# EAGLE design firefly-instrument-power-supply (EAGLE 7.7.0)
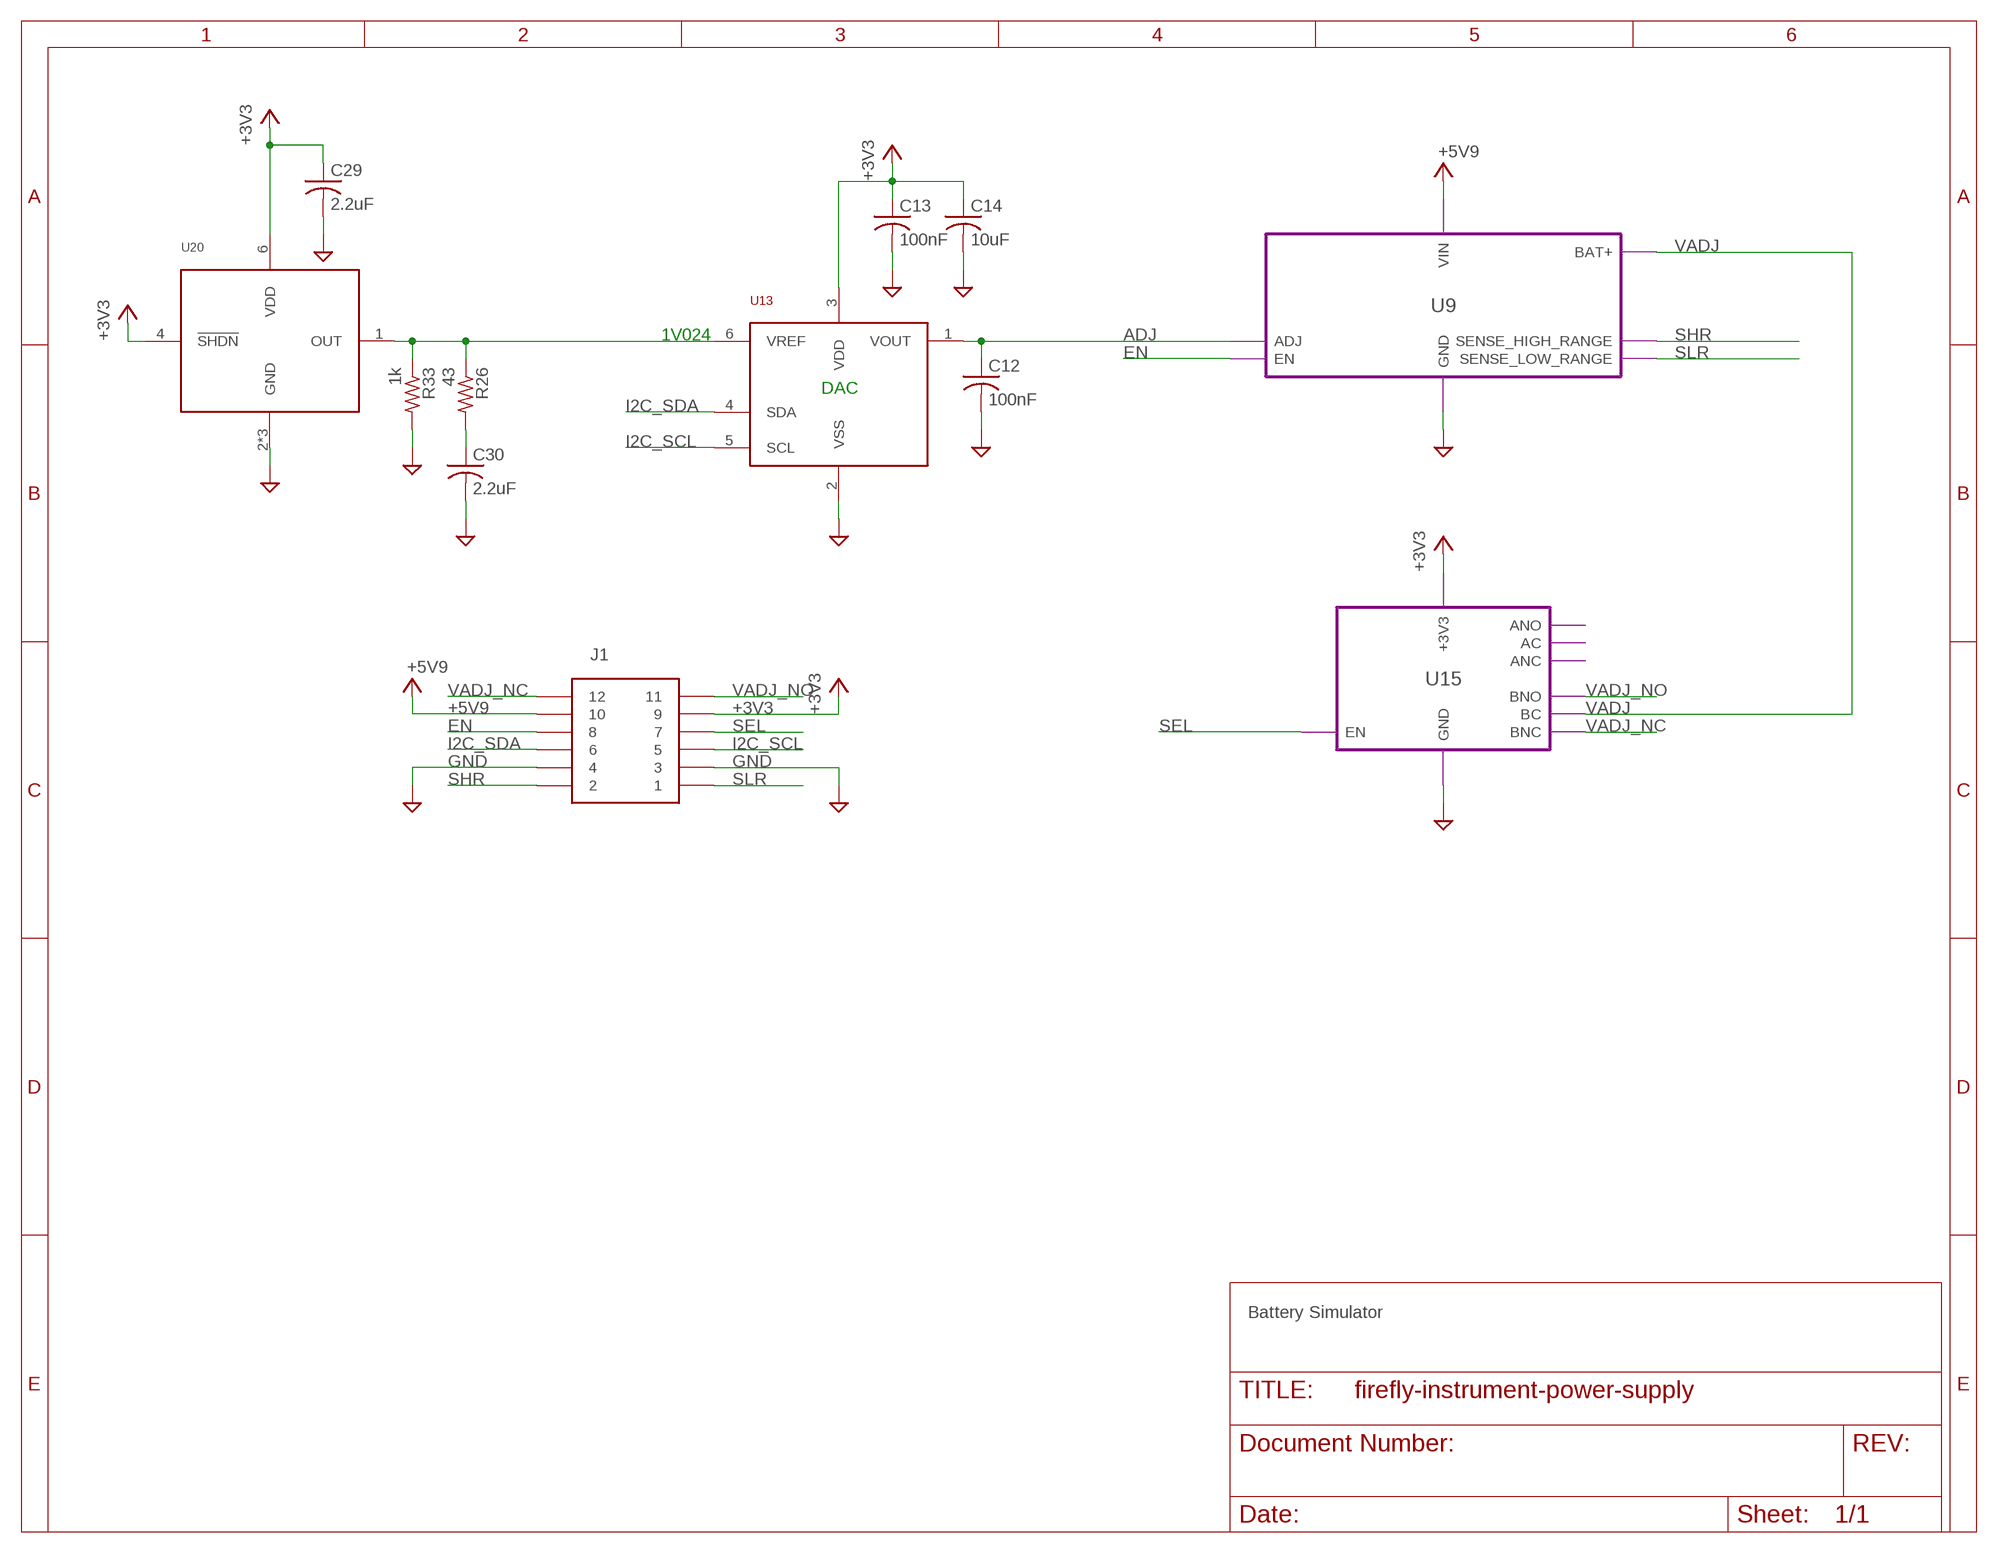
[diagram p0: schematic, sheet 1]

## Parts
C12  100nF  C-USC0805  [C0805]
C13  100nF  C-USC0805  [C0805]
C14  10uF  C-USC0805  [C0805]
C29  2.2uF  C-USC0805  [C0805]
C30  2.2uF  C-USC0805  [C0805]
J1  CON-12CON-HEADER-2X6  [CON-HEADER-2X6]
R26  43  R-USR0805  [R0805]
R33  1k  R-USR0805  [R0805]
U13  MCP47X6  [SOT-23-6]
U20  MCP1501  [SOT-23-6]

## Module instances
U9 = POWER_SUPPLY
U15 = RELAY

## Nets
+3V3: C13.1 C14.1 C29.1 J1.9 U13.3(VDD) U20.4(!SHDN) U20.6(VDD) ; port U15.+3V3
+5V9: J1.10 ; port U9.VIN
ADJ: C12.1 U13.1(VOUT) ; port U9.ADJ
EN: J1.8 ; port U9.EN
GND: C12.2 C13.2 C14.2 C29.2 C30.2 J1.3 J1.4 R33.2 U13.2(VSS) U20.2(GND) U20.3(GND) U20.5(GND) ; port U9.GND U15.GND
I2C_SCL: J1.5 U13.5(SCL)
I2C_SDA: J1.6 U13.4(SDA)
N$22: R26.1 R33.1 U13.6(VREF) U20.1(OUT)
N$30: C30.1 R26.2
SEL: J1.7 ; port U15.EN
SHR: J1.2 ; port U9.SENSE_HIGH_RANGE
SLR: J1.1 ; port U9.SENSE_LOW_RANGE
VADJ: port U15.BC U9.BAT+
VADJ_NC: J1.12 ; port U15.BNC
VADJ_NO: J1.11 ; port U15.BNO

## Notes on the sheet
- 1V024
- DAC
- Battery Simulator

## Library data of the parts
C12 C13 = firefly:C-US: CAPACITOR, American symbol; MANUFACTURER: AVX Corporation; ORDERING-CODE: 08055C104KAT2A
C14 = firefly:C-US: CAPACITOR, American symbol; MANUFACTURER: AVX Corporation; ORDERING-CODE: 0805YD106KAT2A
C29 C30 = firefly:C-US: CAPACITOR, American symbol
J1 = firefly:CON-12
R26 = firefly:R-US: RESISTOR, American symbol; MANUFACTURER: Yageo; ORDERING-CODE: RC0805FR-0743RL
R33 = firefly:R-US: RESISTOR, American symbol; MANUFACTURER: Yageo; ORDERING-CODE: RC0805FR-0710KL
U13 = firefly:MCP47X6; MANUFACTURER: Microchip Technology; ORDERING-CODE: MCP4726A1T-E/CH
U20 = firefly:MCP1501; MANUFACTURER: Microchip Technology; ORDERING-CODE: MCP1501T-10E/CHY

## Module RELAY
Ports: ANO(io) AC(io) ANC(io) BNO(io) BC(io) BNC(io) EN(io) +3V3(pwr) GND(pwr)
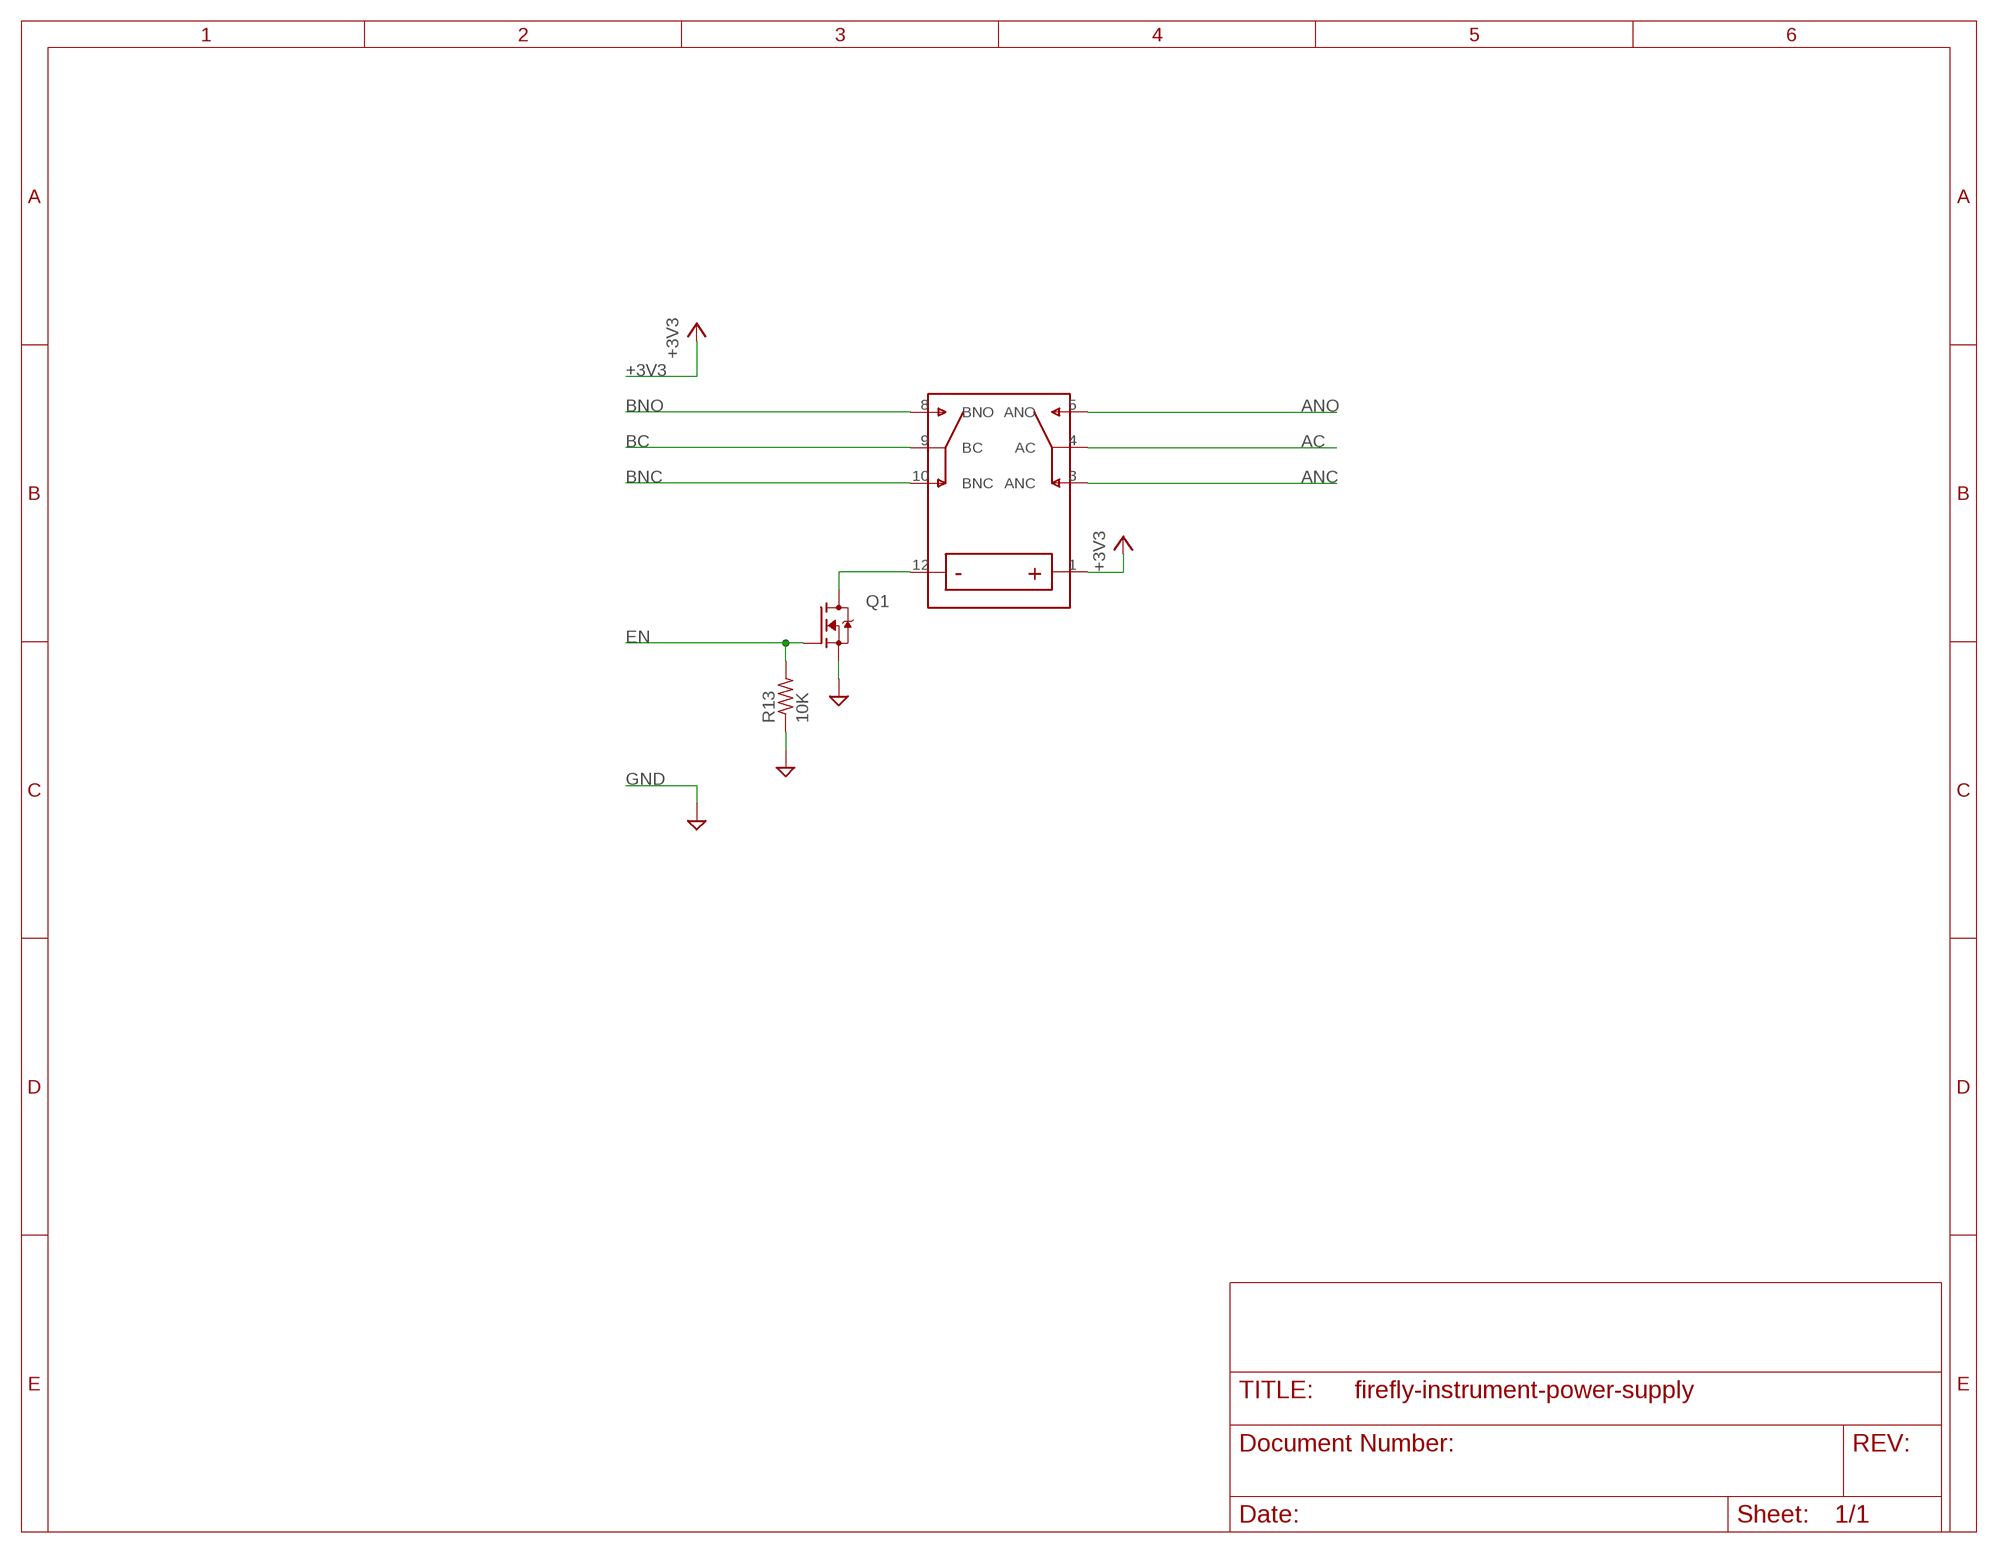
[diagram p1: schematic, module RELAY, sheet 1]

### Parts
Q1  FET-NMCPH3  [MCPH3]
R13  10K  R-USR0805  [R0805]
U1  TXS2SA  [TXS2SA]

### Nets
+3V3: U1.1(+)
AC: U1.4(AC)
ANC: U1.3(ANC)
ANO: U1.5(ANO)
BC: U1.9(BC)
BNC: U1.10(BNC)
BNO: U1.8(BNO)
EN: Q1.1(G) R13.2
GND: Q1.2(S) R13.1
N$2: Q1.3(D) U1.12(-)

### Library data of the parts
Q1 = firefly:FET-N; MANUFACURER: ON Semiconductor; ORDERING-CODE: MCH3481-TL-W
R13 = firefly:R-US: RESISTOR, American symbol; MANUFACTURER: Yageo; ORDERING-CODE: RC0805FR-0710KL
U1 = firefly:TXS2SA; MANUFACTURER: Panasonic Electric Works; ORDERING-CODE: TXS2SA-3V-Z

## Module POWER_SUPPLY
Ports: GND(io) ADJ(io) EN(io) BAT+(io) SENSE_HIGH_RANGE(io) SENSE_LOW_RANGE(io) VIN(pwr)

### Sheet 1 of 2
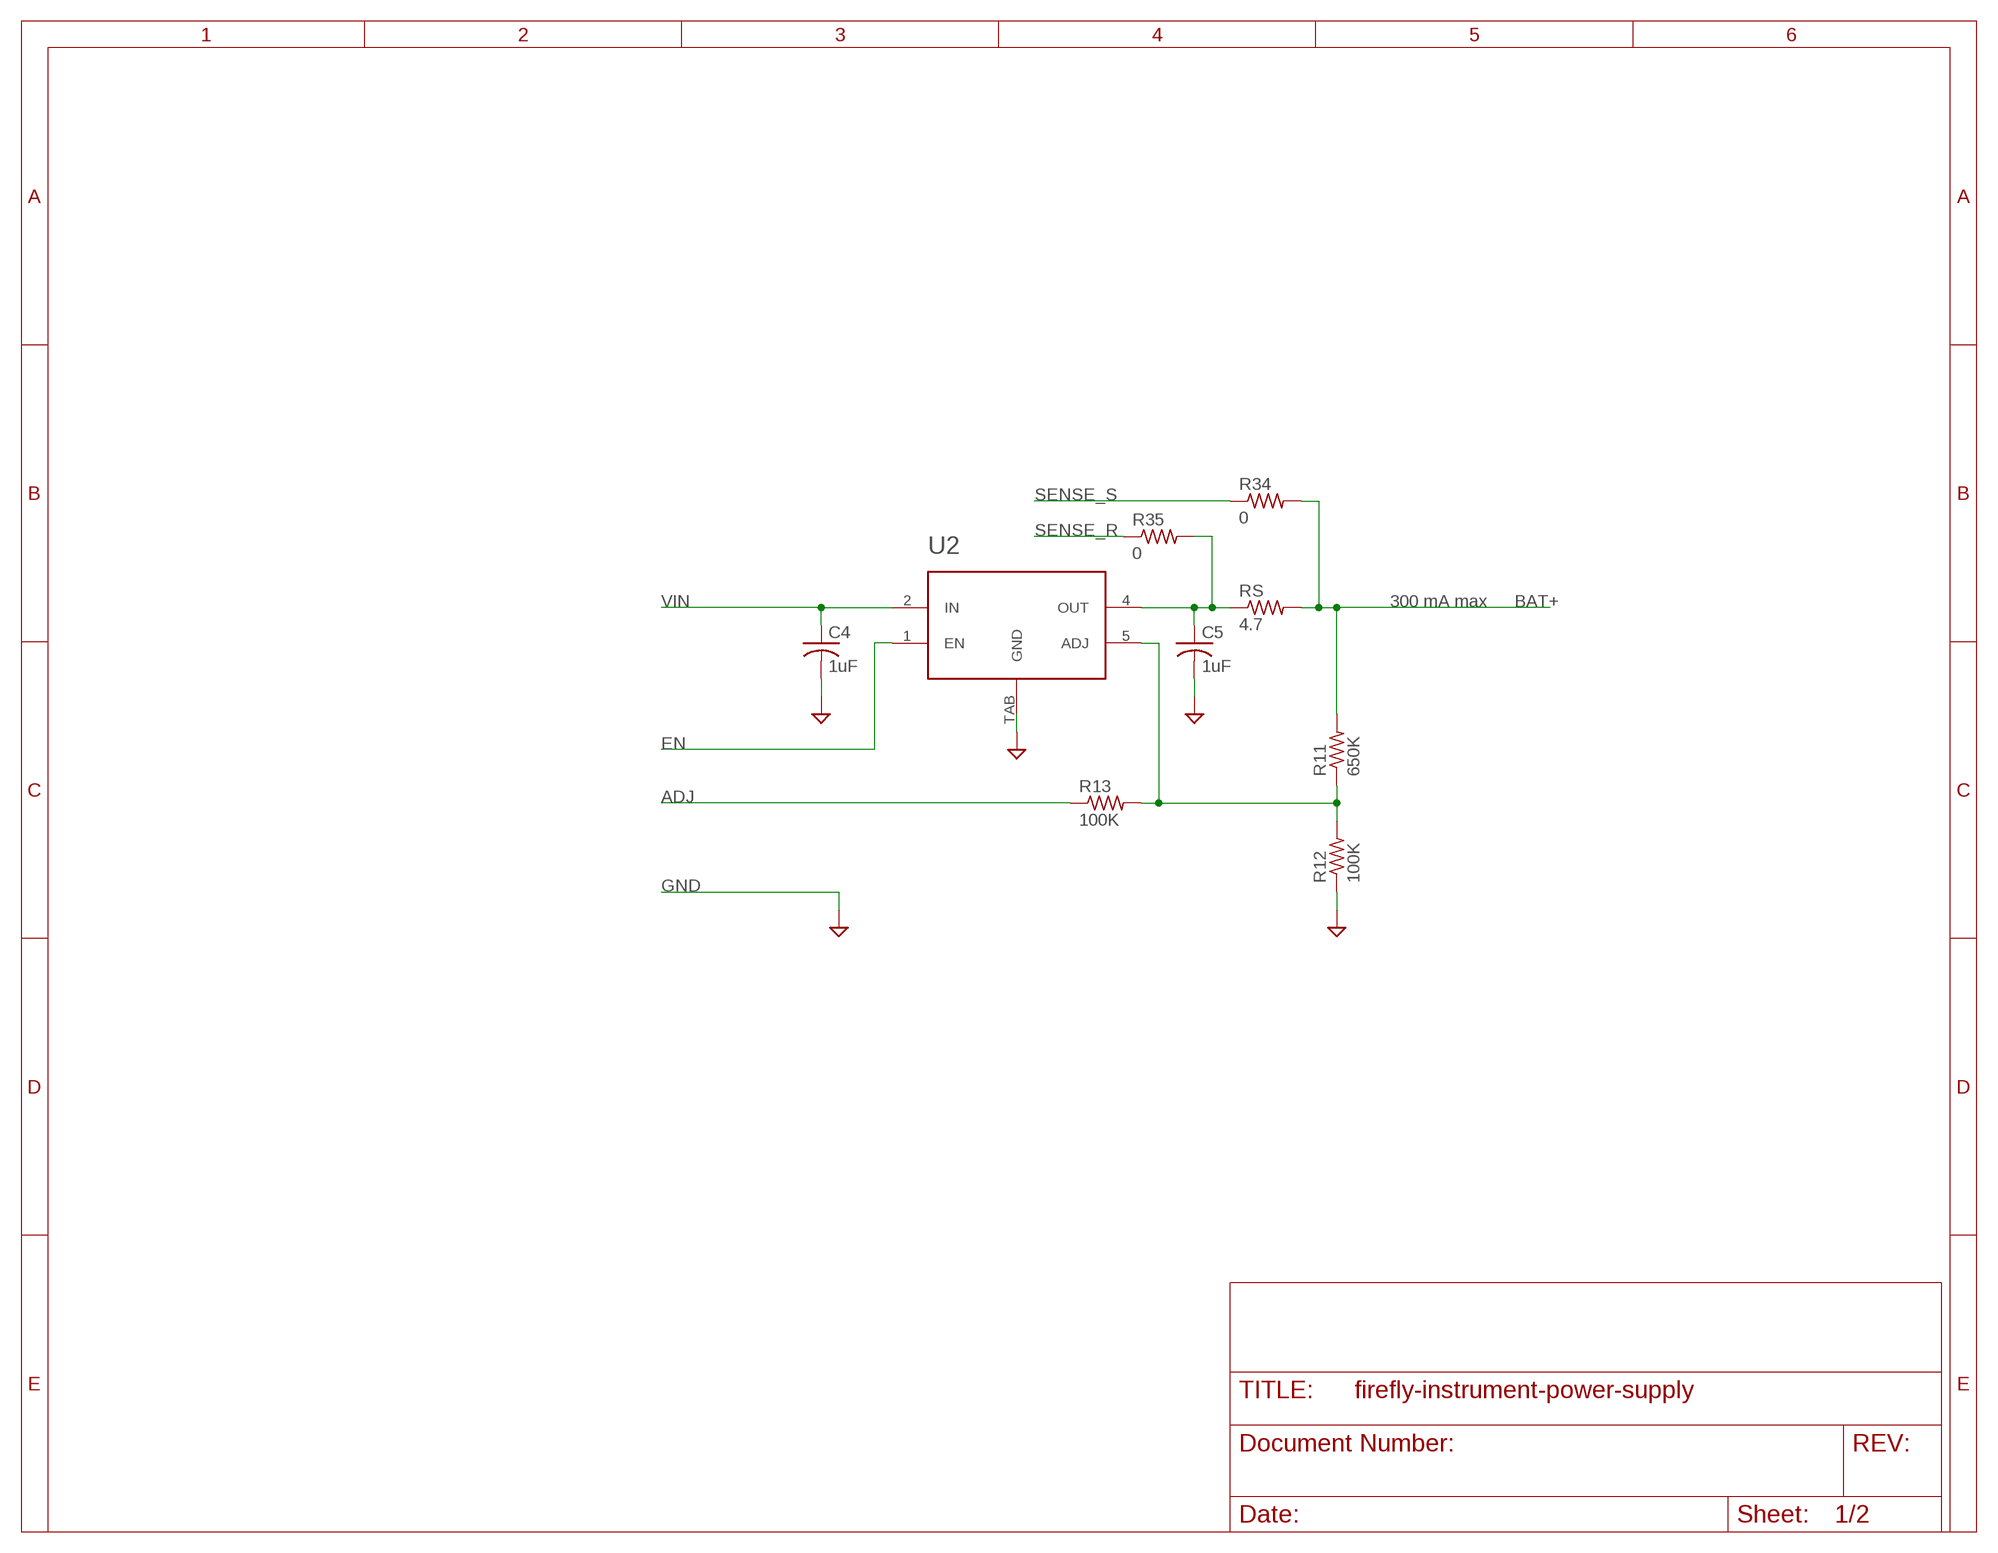
[diagram p2: schematic, module POWER_SUPPLY, sheet 1]

#### Parts
C4  1uF  C-USC0805  [C0805]
C5  1uF  C-USC0805  [C0805]
R11  650K  R-USR0805  [R0805]
R12  100K  R-USR0805  [R0805]
R13  100K  R-USR0805  [R0805]
R34  0  R-USR0805  [R0805]
R35  0  R-USR0805  [R0805]
RS  4.7  R-USR0805  [R0805]
U2  VREG-ADJLDFMPT-TR  [PPAK]

#### Nets
ADJ: R13.1
BAT+: R11.2 R34.2 RS.2
EN: U2.1(EN) ; also sheet 2
GND: C4.2 C5.2 R12.1 U2.TAB(GND) ; also sheet 2
N$4: R11.1 R12.2 R13.2 U2.5(ADJ)
N$35: C5.1 R35.2 RS.1 U2.4(OUT)
SENSE_R: R35.1 ; also sheet 2
SENSE_S: R34.1 ; also sheet 2
VIN: C4.1 U2.2(IN) ; also sheet 2

#### Notes on the sheet
- 300 mA max

### Sheet 2 of 2
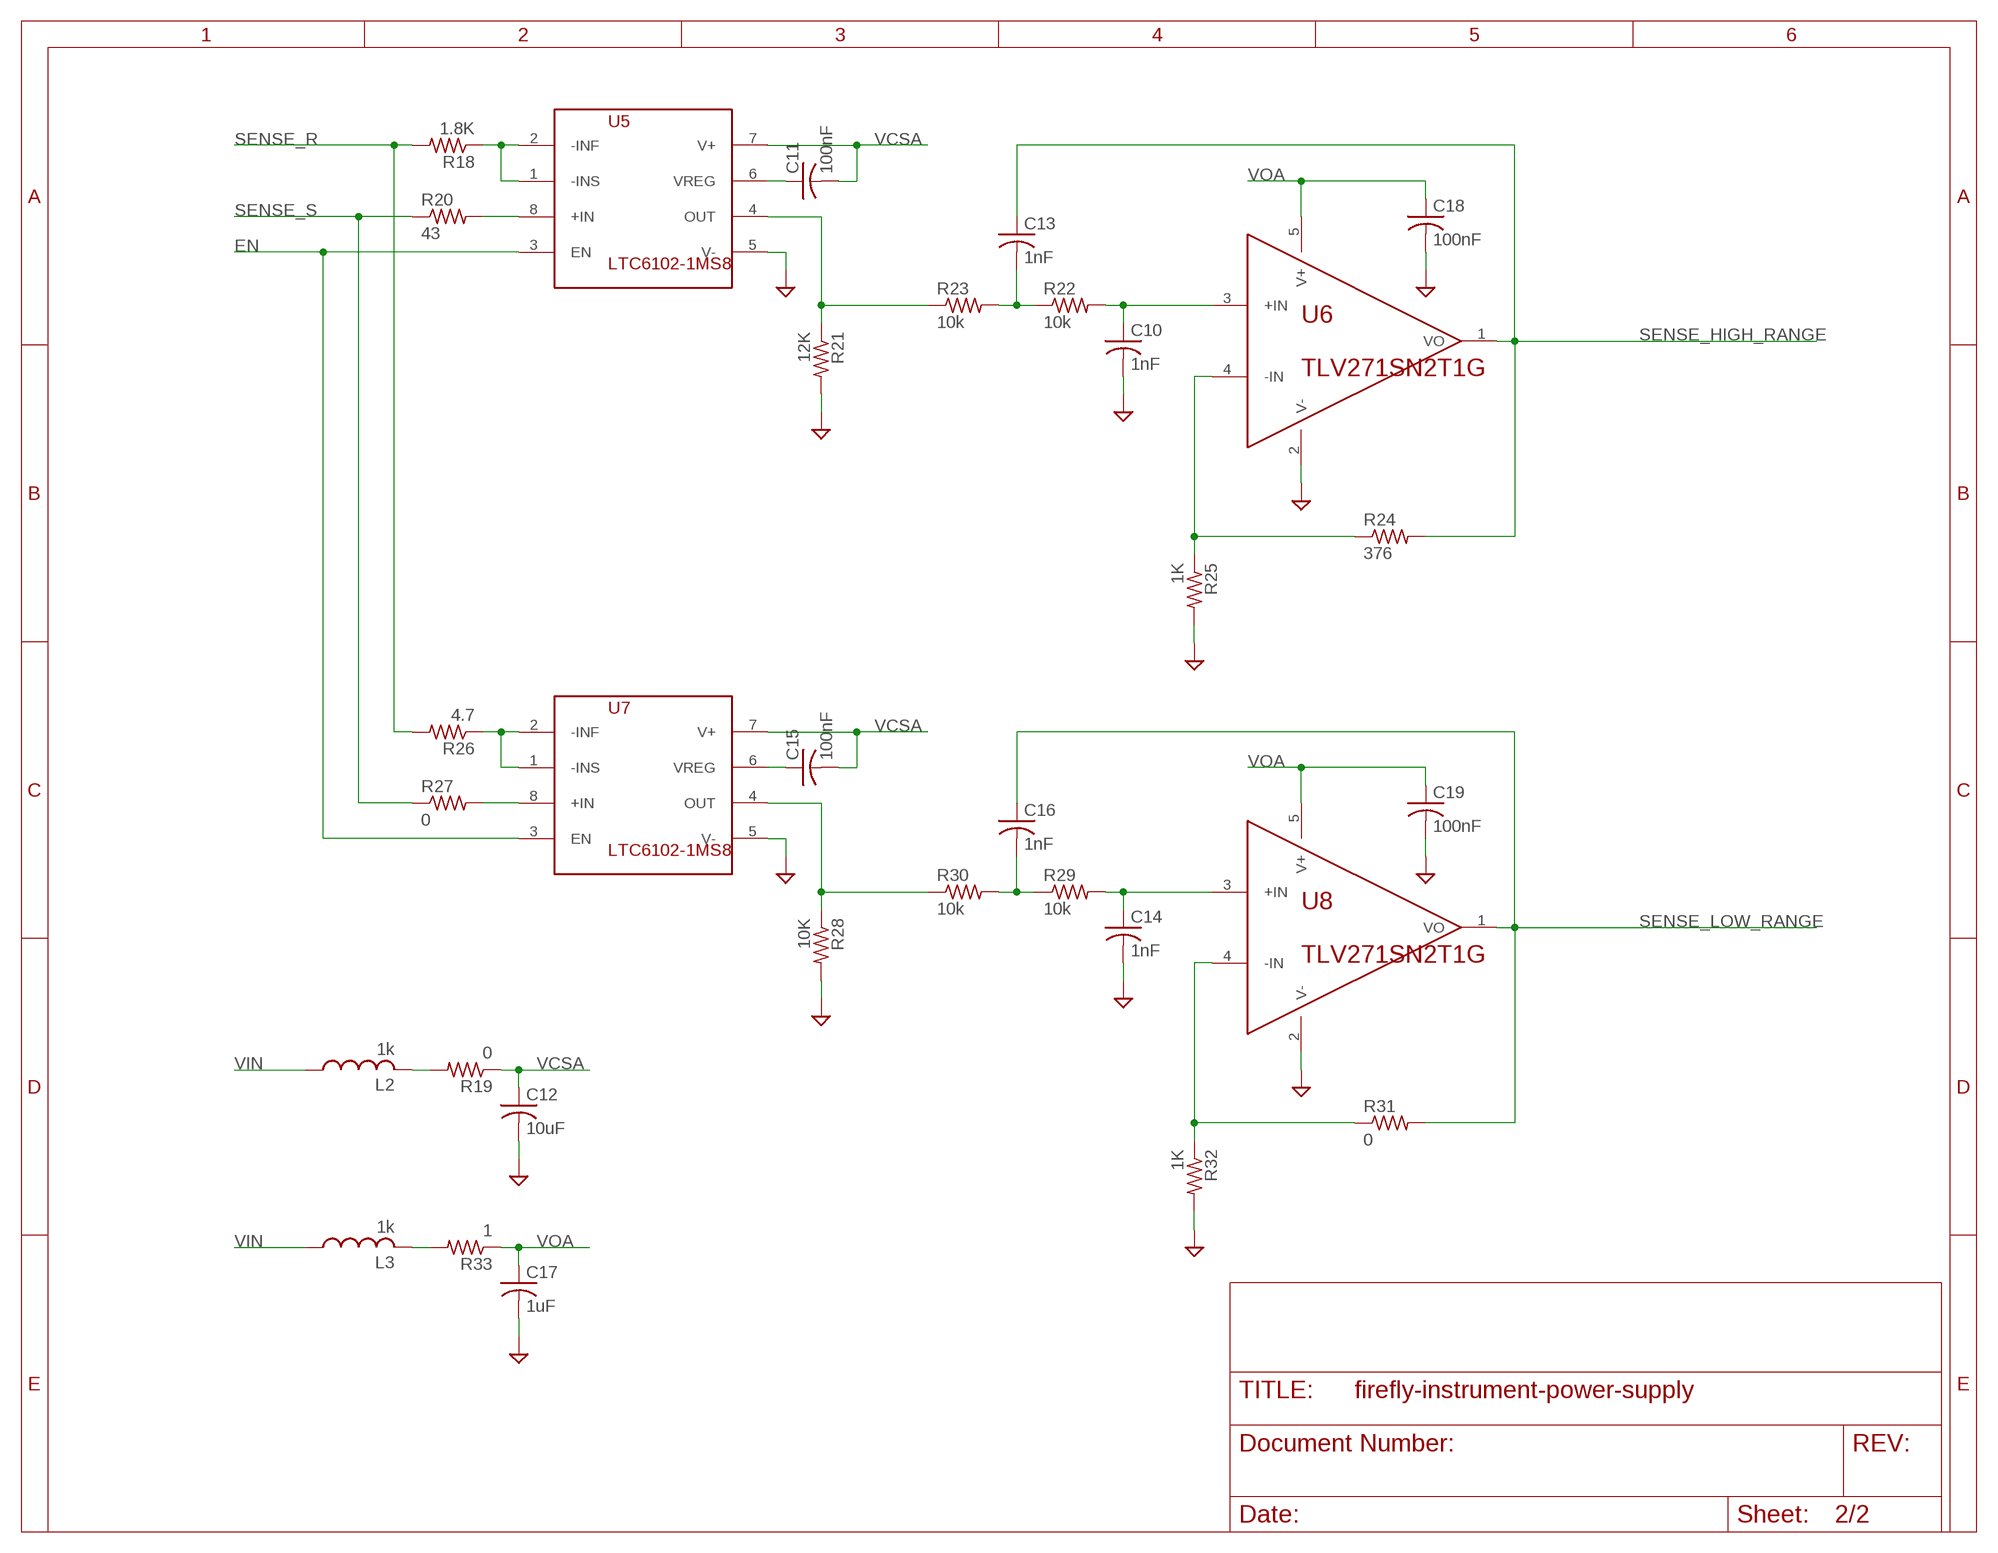
[diagram p3: schematic, module POWER_SUPPLY, sheet 2]

#### Parts
C10  1nF  C-USC0805  [C0805]
C11  100nF  C-USC0805  [C0805]
C12  10uF  C-USC0805  [C0805]
C13  1nF  C-USC0805  [C0805]
C14  1nF  C-USC0805  [C0805]
C15  100nF  C-USC0805  [C0805]
C16  1nF  C-USC0805  [C0805]
C17  1uF  C-USC0805  [C0805]
C18  100nF  C-USC0805  [C0805]
C19  100nF  C-USC0805  [C0805]
L2  1k  L-USL2012C  [L2012C]
L3  1k  L-USL2012C  [L2012C]
R18  1.8K  R-USR0805  [R0805]
R19  0  R-USR0805  [R0805]
R20  43  R-USR0805  [R0805]
R21  12K  R-USR0805  [R0805]
R22  10k  R-USR0805  [R0805]
R23  10k  R-USR0805  [R0805]
R24  376  R-USR0805  [R0805]
R25  1K  R-USR0805  [R0805]
R26  4.7  R-USR0805  [R0805]
R27  0  R-USR0805  [R0805]
R28  10K  R-USR0805  [R0805]
R29  10k  R-USR0805  [R0805]
R30  10k  R-USR0805  [R0805]
R31  0  R-USR0805  [R0805]
R32  1K  R-USR0805  [R0805]
R33  1  R-USR0805  [R0805]
U5  LTC6102-1MS8  [MSOP8]
U6  TLV271SN2T1G  [SOT-23-5]
U7  LTC6102-1MS8  [MSOP8]
U8  TLV271SN2T1G  [SOT-23-5]

#### Nets
EN: U5.3(EN) U7.3(EN) ; also sheet 1
GND: C10.2 C12.2 C14.2 C17.2 C18.2 C19.2 R21.2 R25.2 R28.2 R32.2 U5.5(V-) U6.2(V-) U7.5(V-) U8.2(V-) ; also sheet 1
N$13: L2.2 R19.2
N$14: C11.1 U5.6(VREG)
N$15: R18.1 U5.1(-INS) U5.2(-INF)
N$16: R20.2 U5.8(+IN)
N$17: R21.1 R23.1 U5.4(OUT)
N$18: C13.2 R22.1 R23.2
N$19: C10.1 R22.2 U6.3(+IN)
N$20: R24.1 R25.1 U6.4(-IN)
N$21: C15.1 U7.6(VREG)
N$22: R26.1 U7.1(-INS) U7.2(-INF)
N$23: R27.2 U7.8(+IN)
N$24: R28.1 R30.1 U7.4(OUT)
N$25: C16.2 R29.1 R30.2
N$26: C14.1 R29.2 U8.3(+IN)
N$27: R31.1 R32.1 U8.4(-IN)
N$28: L3.2 R33.2
SENSE_HIGH_RANGE: C13.1 R24.2 U6.1(VO)
SENSE_LOW_RANGE: C16.1 R31.2 U8.1(VO)
SENSE_R: R18.2 R26.2 ; also sheet 1
SENSE_S: R20.1 R27.1 ; also sheet 1
VCSA: C11.2 C12.1 C15.2 R19.1 U5.7(V+) U7.7(V+)
VIN: L2.1 L3.1 ; also sheet 1
VOA: C17.1 C18.1 C19.1 R33.1 U6.5(V+) U8.5(V+)

### Library data of the parts
C4 C5 C17 = firefly:C-US: CAPACITOR, American symbol; MANUFACTURER: Yageo; ORDERING-CODE: CC0805KKX7R7BB105
C10 C13 C14 C16 = firefly:C-US: CAPACITOR, American symbol; ORDERING-CODE: 08055A102JAT2A
C11 C15 C18 C19 = firefly:C-US: CAPACITOR, American symbol; MANUFACTURER: AVX Corporation; ORDERING-CODE: 08055C104KAT2A
C12 = firefly:C-US: CAPACITOR, American symbol; MANUFACTURER: AVX Corporation; ORDERING-CODE: 0805YD106KAT2A
L2 L3 = firefly:L-US: INDUCTOR, American symbol; MANUFACTURER: Murata Electronics; ORDERING-CODE: BLM21BD102SN1D
R11 = firefly:R-US: RESISTOR, American symbol; MANUFACTURER: Yageo; ORDERING-CODE: RC0805FR-07649KL
R12 R13 = firefly:R-US: RESISTOR, American symbol; MANUFACTURER: Yageo; ORDERING-CODE: RC0805FR-07100KL
R18 = firefly:R-US: RESISTOR, American symbol; MANUFACTURER: Yageo; ORDERING-CODE: RC0805FR-071K8L
R19 R27 R31 R34 R35 = firefly:R-US: RESISTOR, American symbol; MANUFACTURER: Yageo; ORDERING-CODE: RC0805FR-070RL
R20 = firefly:R-US: RESISTOR, American symbol; MANUFACTURER: Yageo; ORDERING-CODE: RC0805FR-0743RL
R21 = firefly:R-US: RESISTOR, American symbol; MANUFACTURER: Yageo; ORDERING-CODE: RC0805FR-0712KL
R22 R23 R25 R28-R30 R32 = firefly:R-US: RESISTOR, American symbol; MANUFACTURER: Yageo; ORDERING-CODE: RC0805FR-0710KL
R24 = firefly:R-US: RESISTOR, American symbol; MANUFACTURER: Yageo; ORDERING-CODE: RC0805FR-07374RL
R26 RS = firefly:R-US: RESISTOR, American symbol; MANUFACTURER: Yageo; ORDERING-CODE: RC0805FR-074R7L
R33 = firefly:R-US: RESISTOR, American symbol; MANUFACTURER: Yageo; ORDERING-CODE: RC0805FR-071RL
U2 = firefly:VREG-ADJ; MANUFACTURER: STMicroelectronics; ORDERING-CODE: LDFMPT-TR
U5 U7 = firefly:LTC6102-1; MANUFACTURER: Linear Technology; ORDERING-CODE: LTC6102CMS8-1#PBF
U6 U8 = firefly:TLV271SN2T1G; MANUFACTURER: ON Semiconductor; ORDERING-CODE: TLV271SN2T1G

## Board
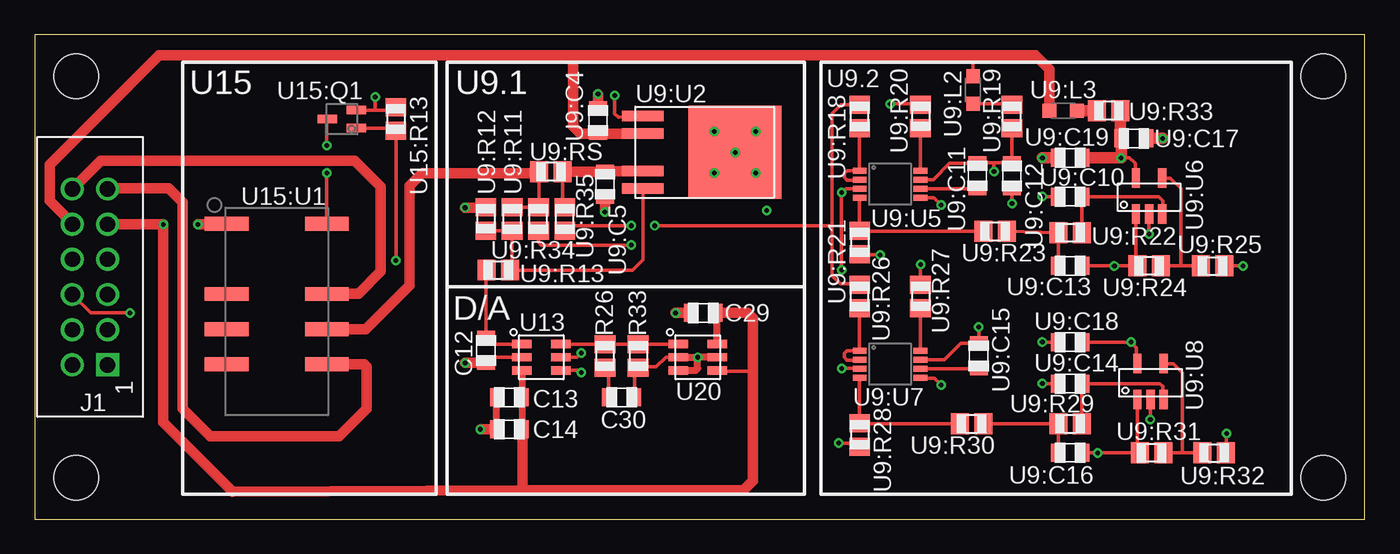
[diagram p4: board, top side]
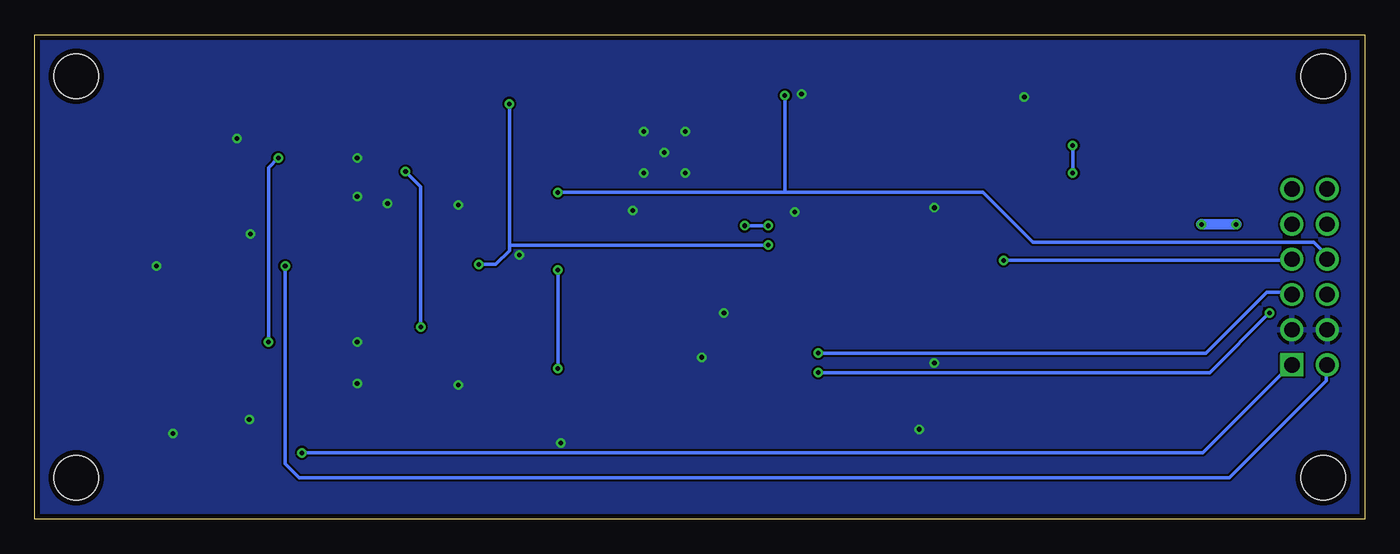
[diagram p5: board, bottom side, seen from below]

Size 96.1 x 35 mm. Coordinates in mm from the lower left corner, seen from the top.
Outline: 0,0 96.1,0 96.1,35 0,35 0,0
Copper layers (1*16): Top 0.0356mm / dielectric 1.5011mm / Bottom 0.0356mm
Design rules "LaenPCBOrder": minimum track width 6mil, minimum drill 13mil, track to track 6mil, track to pad 6mil, pad to pad 6mil, via to via 6mil, smd to smd 6mil, copper to edge 15mil, drill to drill 6mil, minimum pad ring 7mil, minimum via ring 7mil, stop-mask expansion 3mil, vias tented up to drill 0mil, thermal gap 10mil
Holes 3.2 mm at 3,3 3,32 93.1,3 93.1,32

### Footprints (pad centres in the part's own frame; a part is rotated, then mirrored left to right if it is on the bottom)
C0805 = smd 0.9 x 1.3: 1 -0.95,0; 2 0.95,0
CON-HEADER-2X6 = drill 1.102 square: 1 -6.35,-1.27 | drill 1.102: 2 -6.35,1.27; 3 -3.81,-1.27; 4 -3.81,1.27; 5 -1.27,-1.27; 6 -1.27,1.27; 7 1.27,-1.27; 8 1.27,1.27; 9 3.81,-1.27; 10 3.81,1.27; 11 6.35,-1.27; 12 6.35,1.27
R0805 = smd 1.3 x 1.5: 1 -0.85,0; 2 0.85,0
L2012C = smd 1 x 1: 1 -1,0; 2 1,0
PPAK = smd 3 x 0.76: 1 -6.65,2.62; 2 -6.65,1.35; 4 -6.65,-1.35; 5 -6.65,-2.62 | smd 6.7 x 6.7: TAB 0,0
MSOP8 = smd 1 x 0.45: 1 -2.2,0.975; 2 -2.2,0.325; 3 -2.2,-0.325; 4 -2.2,-0.975; 5 2.2,-0.975; 6 2.2,-0.325; 7 2.2,0.325; 8 2.2,0.975
SOT-23-5 = smd 1.4 x 0.6: 1 -1.24,0.94; 2 -1.24,-0.01; 3 -1.24,-0.96; 4 1.34,-0.96; 5 1.34,0.94
SOT-23-6 = smd 1.4 x 0.6: 1 -1.4,0.95; 2 -1.4,0; 3 -1.4,-0.95; 4 1.4,-0.95; 5 1.4,0; 6 1.4,0.95
MCPH3 = smd 1.4 x 0.6: 1 -1.05,0.65; 2 -1.05,-0.65; 3 1.05,0
TXS2SA = smd 3.16 x 1: 1 -3.62,6.35; 3 -3.62,1.27; 4 -3.62,-1.27; 5 -3.62,-3.81; 8 3.62,-3.81; 9 3.62,-1.27; 10 3.62,1.27; 12 3.62,6.35

### Placement (x,y rotation side)
C12  32.6,12.2 270 top
C13  34.3,8.8 180 top
C14  34.3,6.5 180 top
C29  48.3,14.9 180 top
C30  42.4,8.8 0 top
J1  4,17.5 90 top
R26  41.2,11.8 270 top
R33  43.6,11.8 270 top
U9:C4  1uF  [C0805]  40.7,28.8 90 top
U9:C5  1uF  [C0805]  41.2,24.2 270 top
U9:C10  1nF  [C0805]  74.8,23.3 180 top
U9:C11  100nF  [C0805]  68.1,24.8 90 top
U9:C12  10uF  [C0805]  70.6,24.8 270 top
U9:C13  1nF  [C0805]  74.8,18.3 180 top
U9:C14  1nF  [C0805]  74.8,9.8 180 top
U9:C15  100nF  [C0805]  68.2,11.8 90 top
U9:C16  1nF  [C0805]  74.8,4.8 180 top
U9:C17  1uF  [C0805]  79.4,27.5 0 top
U9:C18  100nF  [C0805]  74.8,12.8 180 top
U9:C19  100nF  [C0805]  74.8,26.1 180 top
U9:L2  1k  [L2012C]  67.8,31 270 top
U9:L3  1k  [L2012C]  74.3,29.5 0 top
U9:R11  650K  [R0805]  34.5,21.7 90 top
U9:R12  100K  [R0805]  32.6,21.7 270 top
U9:R13  100K  [R0805]  33.5,18 0 top
U9:R18  1.8K  [R0805]  59.6,29.1 90 top
U9:R19  0  [R0805]  70.6,29.1 90 top
U9:R20  43  [R0805]  64,29.1 270 top
U9:R21  12K  [R0805]  59.6,20 270 top
U9:R22  10k  [R0805]  74.8,20.7 0 top
U9:R23  10k  [R0805]  69.4,20.8 0 top
U9:R24  376  [R0805]  80.5,18.3 180 top
U9:R25  1K  [R0805]  85.1,18.3 0 top
U9:R26  4.7  [R0805]  59.6,16.1 90 top
U9:R27  0  [R0805]  64,16.1 270 top
U9:R28  10K  [R0805]  59.6,6.1 270 top
U9:R29  10k  [R0805]  74.8,6.9 0 top
U9:R30  10k  [R0805]  67.7,6.9 0 top
U9:R31  0  [R0805]  80.7,4.8 180 top
U9:R32  1K  [R0805]  85.2,4.8 0 top
U9:R33  1  [R0805]  77.6,29.5 180 top
U9:R34  0  [R0805]  36.4,21.7 90 top
U9:R35  0  [R0805]  38.3,21.7 90 top
U9:RS  4.7  [R0805]  37.3,25.1 180 top
U9:U2  VREG-ADJLDFMPT-TR  [PPAK]  50.6,26.5 0 top
U9:U5  LTC6102-1MS8  [MSOP8]  61.8,24.2 0 top
U9:U6  TLV271SN2T1G  [SOT-23-5]  80.5,23.3 90 top
U9:U7  LTC6102-1MS8  [MSOP8]  61.8,11.2 0 top
U9:U8  TLV271SN2T1G  [SOT-23-5]  80.6,9.9 90 top
U13  36.6,11.7 0 top
U15:Q1  FET-NMCPH3  [MCPH3]  22.2,28.9 180 top
U15:R13  10K  [R0805]  26.1,28.9 270 top
U15:U1  TXS2SA  [TXS2SA]  17.5,15 0 top
U20  47.9,11.7 0 top

### Tracks (layer width: path | path; a pad name or v marks a point on that pad's centre or on a via)
+3V3  (via drill 0.33)
  Top 0.254: U20.4 49.35,10.7 51.9,10.7
  Top 0.5: C14.1 C13.1 35.2,8.85 U13.3 | U20.6 49.3,14.85 C29.1
  Top 0.75: J1.9 v9.3,21.3 9.3,7 14.3,2 35.3,2.1 | v11.8,21.3 13.83,21.3 U15:U1.1 | 35.3,2.1 51.2,2.1 51.9,2.8 51.9,10.7 51.9,14.5 51.5,14.9 C29.1 | C14.1 35.25,2.15 35.3,2.1
  Bottom 0.75: v9.3,21.3 v11.8,21.3
+5V9
  Top 0.254: U9:L2.1 67.8,33.5
  Top 0.75: U9:U2.2 U9:C4.1 39.45,27.85 38.9,28.4 38.9,33.4 39,33.5 | U9:L3.1 73.3,32.5 72.3,33.5 67.8,33.5 39,33.5 | 39,33.5 9,33.5 1.1,25.6 1.1,23 2.73,21.37 J1.10
ADJ
  Top 0.254: U13.1 33.1,12.65 C12.1 32.6,18.05 U9:R13.1
EN  (via drill 0.33)
  Top 0.254: U9:U5.3 58.6,23.88 58.5,23.8 v58.3,23.6 v58.3,18 | v58.3,10.9 59.58,10.9 U9:U7.3 | U9:U2.1 42.18,29.02 41.9,29.3 v41.9,30.6
  Bottom 0.254: v58.3,18 v58.3,10.9 | J1.8 2.73,19.03 3.7,20 24,20 27.6,23.6 41.9,23.6 | v41.9,30.6 41.9,23.6 | v58.3,23.6 41.9,23.6
GND  (via drill 0.33)
  Top 0.254: U9:R28.2 59.35,5.5 v58.1,5.5 | v65.5,9.7 65,10.2 64.03,10.2 U9:U7.5 | v61.1,19.1 59.7,19.1 U9:R21.2 | U9:U5.5 64.97,23.23 v65.5,22.7 | v86.1,6.2 86.1,4.85 U9:R32.2 | U9:C18.2 v72.8,12.8 | v87.3,18.3 U9:R25.2 | U9:C10.2 v72.8,23.3 | U9:C12.2 v70.6,22.8 | U9:C14.2 v72.8,9.8 | U13.2 33.05,11.7 C12.2 | U9:U8.2 80.61,7.01 v80.6,7.2 | v80.5,20.6 U9:U6.2 | U15:Q1.2 24.6,29.55 | 24.6,29.55 25.9,29.55 U15:R13.1 | v24.6,30.5 24.6,29.55 | U20.2 45.6,11.7 44.9,11 43.65,11 | C30.2 43.35,10.7 R33.2
  Top 0.5: C13.2 C14.2 | U20.5 v47.9,11.7 | U20.2 v47.9,11.7 | U20.3 47.75,10.75 47.9,10.9 v47.9,11.7 | 43.65,11 R33.2
  Top 0.75: C12.2 32.5,11.3 v31.1,11.3 | v32.2,6.5 C14.2 | v41.2,22.2 U9:C5.2 | v40.7,30.7 U9:C4.2 | v46.3,14.9 C29.2 | v31.1,22.5 32.55,22.5 U9:R12.1
  Top 0.813: U9:C17.2 v81.5,27.5 | U9:C19.2 v72.8,26.1
  other vias: 50.6,26.5 52.9,22.3 52.1,28 52.1,25 49.1,25 49.1,28
  pour Bottom: 0,0 96.1,0 96.1,35 0,35
I2C_SCL  (via drill 0.33)
  Top 0.254: U13.5 39.2,11.7 v39.5,12
  Bottom 0.254: v39.5,12 11.5,12 7.1,16.4 5.44,16.4 J1.5
I2C_SDA  (via drill 0.33)
  Top 0.254: U13.4 39.35,10.75 v39.5,10.6 | v6.9,14.9 4.06,14.9 J1.6
  Bottom 0.254: v39.5,10.6 11.2,10.6 v6.9,14.9
N$22
  Top 0.254: U20.1 R33.1 R26.1 U13.6
N$30
  Top 0.254: C30.1 41.45,10.7 R26.2
SEL  (via drill 0.33)
  Top 0.254: v26.1,18.7 U15:R13.2 25.9,28.25 U15:Q1.1
  Bottom 0.254: J1.7 5.34,18.7 v26.1,18.7
SHR  (via drill 0.33)
  Top 0.254: U9:C13.1 v78,18.3 U9:R24.2 | 79.7,18.3 U9:R24.2 | U9:U6.1 79.56,18.39 U9:R24.2
  Bottom 0.254: J1.2 2.73,11.33 2.8,10 9.8,3 77,3 78,4 v78,18.3
SLR  (via drill 0.33)
  Top 0.254: U9:C16.1 v76.8,4.8 U9:R31.2 79.66,4.99 U9:U8.1
  Bottom 0.254: J1.1 5.35,11.15 11.7,4.8 v76.8,4.8
U9:N$4
  Top 0.254: U9:R12.2 U9:R11.1 34.5,18 | U9:R13.2 34.5,18 | U9:U2.5 43.95,18.75 43.2,18 34.5,18
U9:N$13
  Top 0.254: U9:R19.2 70.3,30 U9:L2.2
U9:N$14
  Top 0.254: U9:U5.6 68.08,23.88 U9:C11.1
U9:N$15
  Top 0.254: U9:R18.1 U9:U5.1 58.67,25.18 58.5,25 58.5,24.7 58.7,24.5 59.58,24.5 U9:U5.2
U9:N$16
  Top 0.254: U9:R20.2 U9:U5.8
U9:N$17
  Top 0.254: U9:U5.4 U9:R21.1 59.7,20.8 U9:R23.1
U9:N$18
  Top 0.254: U9:R23.2 U9:R22.1 73.95,18.4 U9:C13.2
U9:N$19
  Top 0.254: U9:R22.2 75.65,23.3 U9:C10.1 81.2,23.3 81.5,23 81.5,22.12 U9:U6.3
U9:N$20
  Top 0.254: 81.46,18.41 U9:R24.1 82.8,18.3 | 82.8,18.3 U9:R25.1 | U9:U6.4 82.06,24.64 82.8,23.9 82.8,18.3
U9:N$21
  Top 0.254: U9:U7.6 68.17,10.88 U9:C15.1
U9:N$22
  Top 0.254: U9:R26.1 U9:U7.1 58.67,12.18 58.5,12 58.5,11.7 58.7,11.5 59.58,11.5 U9:U7.2
U9:N$23
  Top 0.254: U9:R27.2 U9:U7.8
U9:N$24
  Top 0.254: U9:U7.4 U9:R28.1 59.65,6.9 U9:R30.1
U9:N$25
  Top 0.254: U9:R30.2 U9:R29.1 73.95,4.9 U9:C16.2
U9:N$26
  Top 0.254: U9:R29.2 75.65,9.7 U9:C14.1 81.3,9.8 81.5,9.6 81.5,8.72 U9:U8.3
U9:N$27
  Top 0.254: U9:R31.1 82.9,4.8 | 82.9,4.8 U9:R32.1 | U9:U8.4 82.26,11.24 82.9,10.6 82.9,4.8
U9:N$28
  Top 0.813: U9:L3.2 U9:R33.2
U9:N$35
  Top 0.254: U9:RS.1 38.15,22.7 U9:R35.2
  Top 0.75: U9:U2.4 U9:C5.1 41.15,25.1 U9:RS.1
U9:SENSE_R  (via drill 0.33)
  Top 0.254: 57.6,21.2 57.6,29.3 58.25,29.95 U9:R18.2 59.65,29.9 | 57.6,21.2 57.6,17.6 58.2,17 59.55,17 U9:R26.2 | U9:R35.1 38.65,21.2 v43.1,21.2 | v44.8,21.2 57.6,21.2
  Bottom 0.254: v43.1,21.2 v44.8,21.2
U9:SENSE_S  (via drill 0.33)
  Top 0.254: U9:R27.1 v64,18.4 | v61.8,30 64.05,30 U9:R20.1 | U9:R34.1 36.4,20 36.6,19.8 v43.1,19.8
  Bottom 0.254: v64,18.4 62.8,18.4 61.8,19.4 61.8,19.8 | 61.8,19.8 v61.8,30 | v43.1,19.8 61.8,19.8
U9:VCSA  (via drill 0.33)
  Top 0.254: U9:U7.7 65.72,11.53 66.9,12.7 68.15,12.7 U9:C15.2 v68.2,13.9 | U9:U5.7 64.92,24.52 66.1,25.7 68.05,25.7 U9:C11.2 69.2,25.75 | 69.2,25.75 U9:C12.1 U9:R19.1 | v69.3,25.1 69.3,25.65 69.2,25.75
  Bottom 0.254: v68.2,13.9 68.2,24 v69.3,25.1
U9:VOA  (via drill 0.33)
  Top 0.254: U9:C18.1 v79.2,12.8 79.6,12.4 79.6,11.3 U9:U8.5 | v78.5,26.1 79.1,26.1 79.5,25.7 79.5,24.7 U9:U6.5 | 78.5,27.45 U9:C17.1
  Top 0.813: U9:C19.1 v78.5,26.1 78.5,27.45 | U9:R33.1 U9:C17.1
  Bottom 0.254: v78.5,26.1 79.2,25.4 v79.2,12.8
U15:N$2  (via drill 0.33)
  Top 0.254: U15:Q1.3 21.1,28.85 v21.1,27 | v21.1,25 21.1,21.37 U15:U1.12
  Bottom 0.254: v21.1,27 v21.1,25
VADJ
  Top 0.254: U9:R11.2 U9:R34.2 36.45,22.6 U9:RS.2
  Top 0.75: U15:U1.9 23.93,13.73 27.1,16.9 27.1,24.1 28,25 36.35,25 U9:RS.2
VADJ_NC
  Top 0.75: J1.12 4.78,25.9 23.1,25.9 25,24 25,17.9 23.4,16.3 22.8,16.3 22.77,16.27 U15:U1.10
VADJ_NO
  Top 0.75: U15:U1.8 23.81,11.19 24,11 24,8 22,6 12.7,6 10.7,8 10.7,22.9 9.7,23.9 5.32,23.9 J1.11

### Text on the board
_tsilk: U15 | U9.1 | U9.2 | D/A
_bsilk: Firefly Instruments / Power Supply / Revision 0.5 2017/03/01 / Copyright Firefly Design LLC